# Altium project Carte_Nucleo.PrjPcb
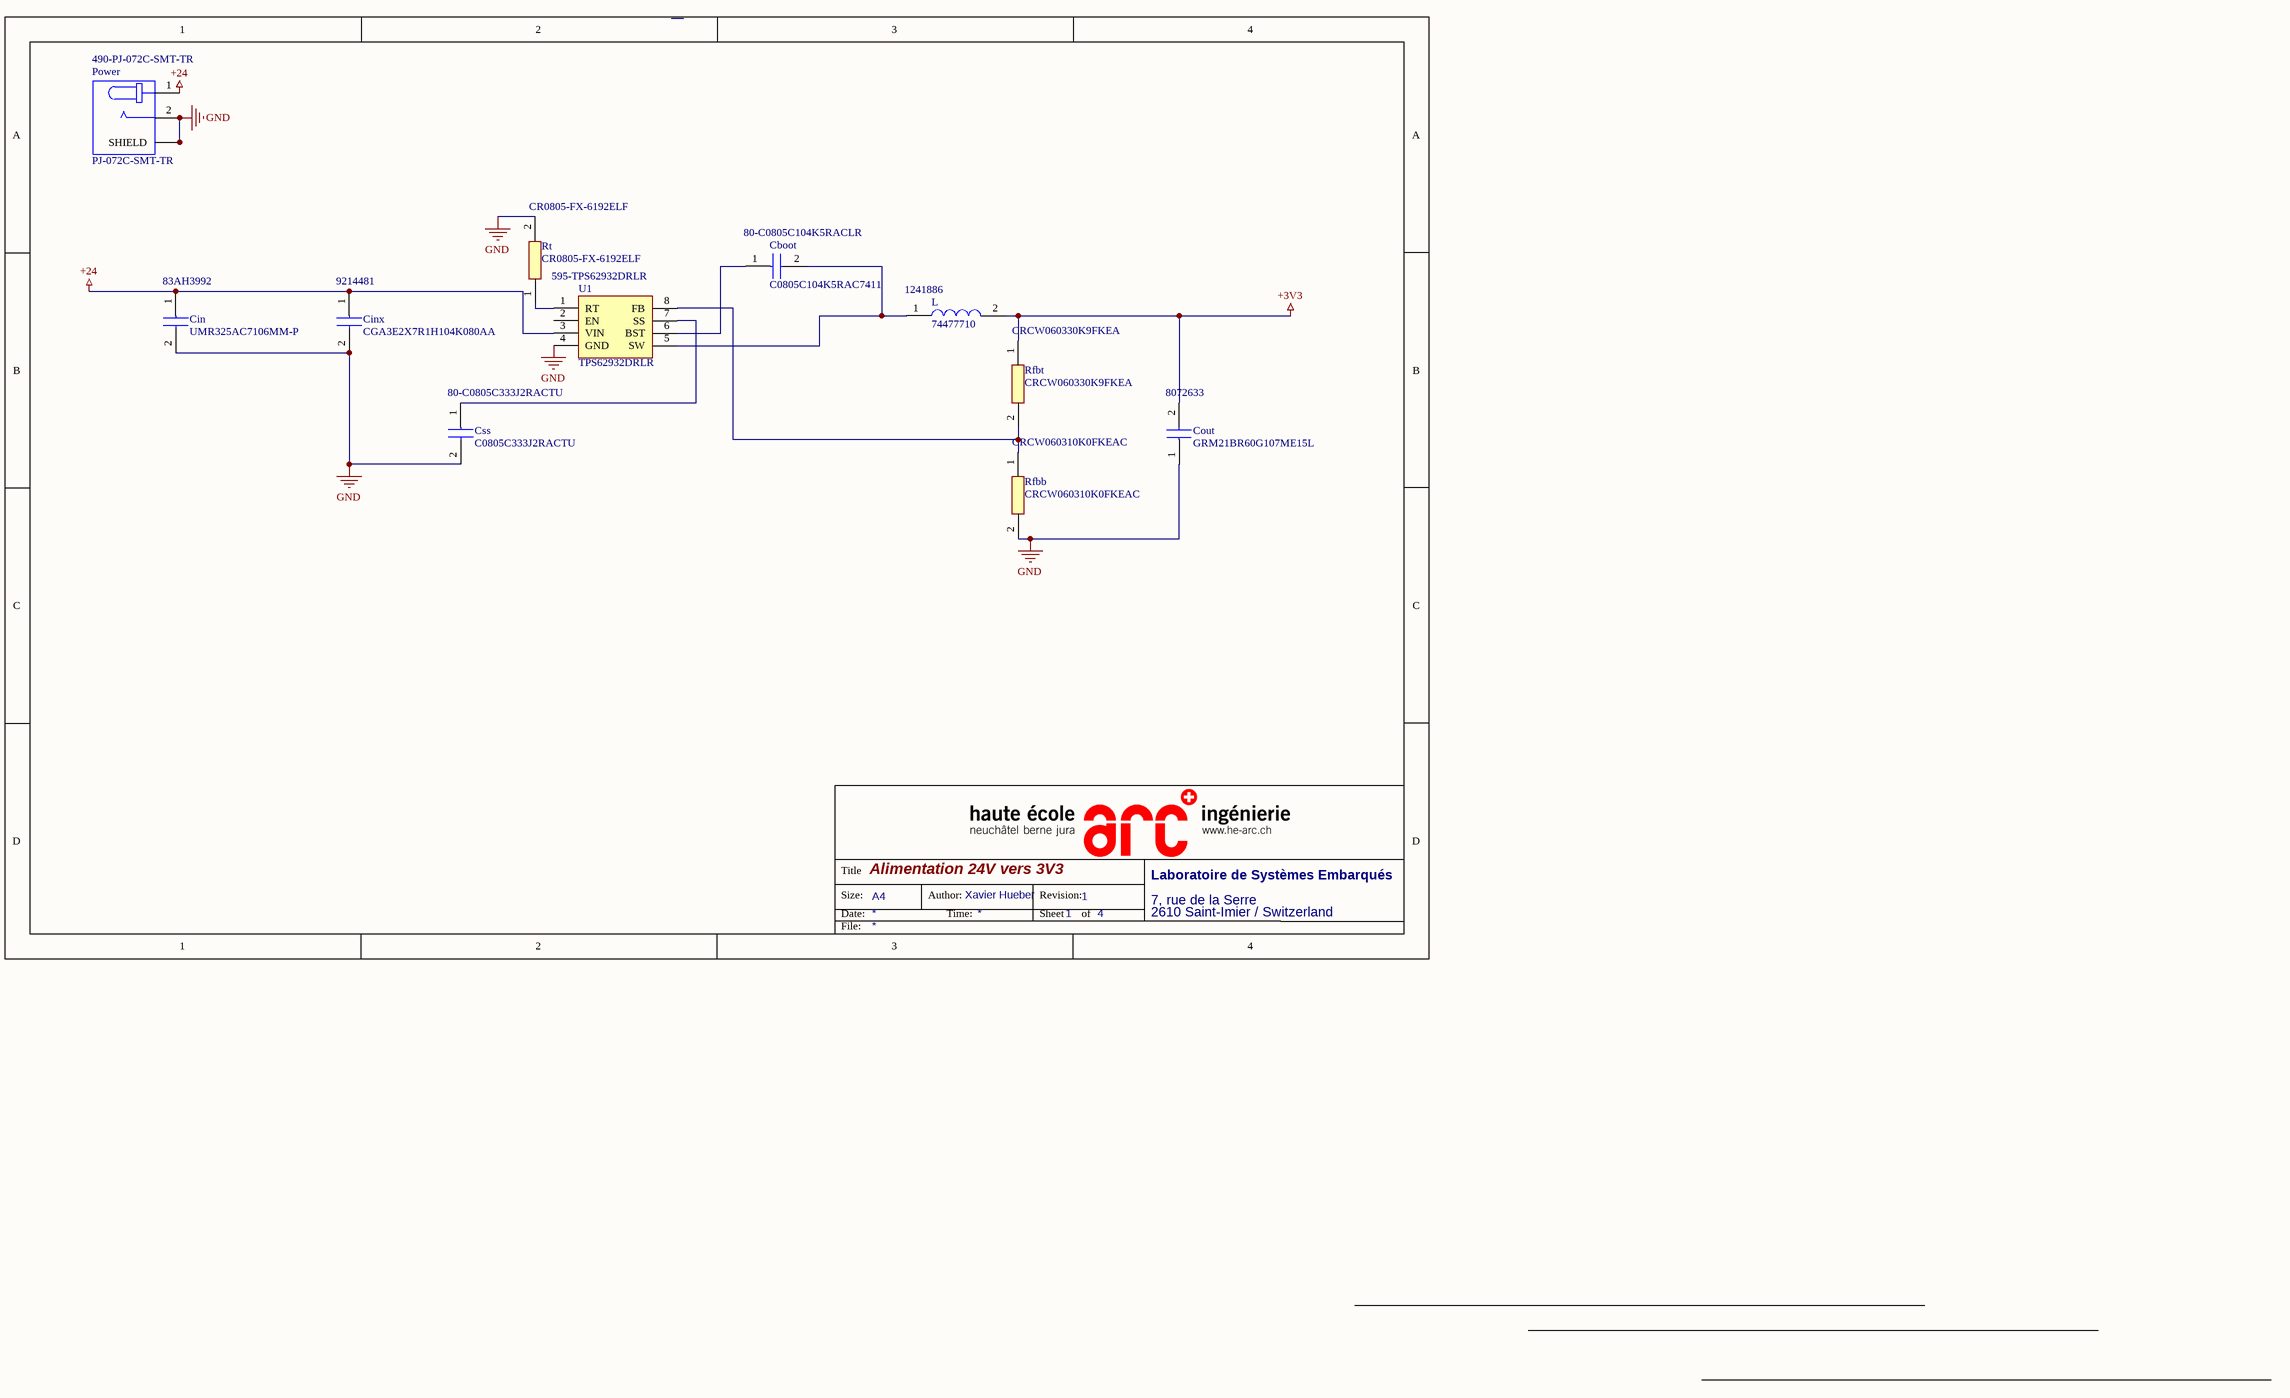
[diagram p0: Alimentation.SchDoc]
4 sheets, 66 parts. Net scope: global (net labels, ports and power ports of the same name join across sheets).
Board file: Carte_Nucleo.PcbDoc
Sheets:
  Alimentation.SchDoc
  Connecteur_Nucleo.SchDoc
  IO_Carte_Nucleo.SchDoc
  IO_Carte_Nucleo2.SchDoc

## Sheet Alimentation.SchDoc: Alimentation 24V vers 3V3
size A4; Author: Xavier Hueber; Engineer: Xavier Hueber; Organization: Altium Limited; Address1: Laboratoire de Systèmes Embarqués; Address2: 7, rue de la Serre; Address3: 2610 Saint-Imier / Switzerland; Revision: 1; SheetNumber: 1; SheetTotal: 4

### Parts
Cboot  C0805C104K5RAC7411  Supplier Part Number 1: 80-C0805C104K5RACLR  [CAPC2012X88N]
Cin  UMR325AC7106MM-P  Supplier Part Number 1: 83AH3992  [CAPC3225X280N]
Cinx  CGA3E2X7R1H104K080AA  Supplier Part Number 1: 9214481  [CAPC1608X90N]
Cout  GRM21BR60G107ME15L  Supplier Part Number 1: 8072633  [CAPC2012X145N]
Css  C0805C333J2RACTU  Supplier Part Number 1: 80-C0805C333J2RACTU  [C0805]
L  74477710  Supplier Part Number 1: 1241886  [74477710]
Power  PJ-072C-SMT-TR  Supplier Part Number 1: 490-PJ-072C-SMT-TR  [PJ-072C-SMT-TR]
Rfbb  CRCW060310K0FKEAC  [RESC1608X55N]
Rfbt  CRCW060330K9FKEA  [RESC1608X50N]
Rt  CR0805-FX-6192ELF  [RESC2012X60N]
U1  TPS62932DRLR  Supplier Part Number 1: 595-TPS62932DRLR  [TPS62932DRLR]

### Nets
+3V3: Cout.2 L.2 Rfbt.1
+24: Cin.1 Cinx.1 Power.1 U1.3(VIN)
GND: Cin.2 Cinx.2 Cout.1 Css.2 Power.2 Power.3(SHIELD) Power.4(SHIELD) Rfbb.2 Rt.2 U1.4(GND)
NetCboot_1: Cboot.1 U1.6(BST)
NetCboot_2: Cboot.2 L.1 U1.5(SW)
NetCss_1: Css.1 U1.7(SS)
NetRfbb_1: Rfbb.1 Rfbt.2 U1.8(FB)
NetRt_1: Rt.1 U1.1(RT)

Not connected (* = marked no-connect by the designer): U1 2(EN)

### Notes on the sheet
- Title
- Size:
- Date:
- A4
- Author:
- Time:
- Revision:
- Sheet
- of
- File:

### Library data of the parts
Cboot = C0805C104K5RAC7411: Multilayer Ceramic Capacitors MLCC - SMD/SMT 50V 0.1uF X7R 0805 10%; Manufacturer_Name: KEMET; Datasheet Link: https://componentsearchengine.com//C0805C104K5RAC7411.pdf; Height: 0.88mm; Mouser2 Part Number: 80-C0805C104K5RACLR; Mouser2 Price/Stock: https://www.mouser.com/Search/Refine.aspx?Keyword=80-C0805C104K5RACLR; Manufacturer_Part_Number: C0805C104K5RAC7411; Supplier 1: Mouser
Cin = UMR325AC7106MM-P: Capacitor 1210 50V 10uF +-20%; Manufacturer_Name: TAIYO YUDEN; Height: 2.8mm; Manufacturer_Part_Number: UMR325AC7106MM-P; Supplier 1: Newark
Cinx = CGA3E2X7R1H104K080AA: Capacitor 0603 100nF; Manufacturer_Name: TDK; Datasheet Link: https://componentsearchengine.com//CGA3E2X7R1H104K080AA.pdf; Height: 0.9mm; Mouser2 Part Number: 810-CGA3E2X7R1H104K; Mouser2 Price/Stock: https://www.mouser.com/Search/Refine.aspx?Keyword=810-CGA3E2X7R1H104K; Manufacturer_Part_Number: CGA3E2X7R1H104K080AA; Supplier 1: RSComponents
Cout = GRM21BR60G107ME15L: 0805 100 uF 4 V ±20% Tolerance X5R Multilayer Ceramic Chip Capacitor; Manufacturer_Name: Murata Electronics; Datasheet Link: https://datasheet.datasheetarchive.com/originals/distributors/DKDS-10/192999.pdf; Height: 1.45mm; Manufacturer_Part_Number: GRM21BR60G107ME15L; Supplier 1: Future Electronics
Css = C0805C333J2RACTU: Multilayer Ceramic Capacitors MLCC - SMD/SMT 200V 0.033uF X7R 0805 5%; Manufacturer_Name: KEMET; Datasheet Link: https://content.kemet.com/datasheets/KEM_C1002_X7R_SMD.pdf; Height: 1.1mm; Manufacturer_Part_Number: C0805C333J2RACTU; Supplier 1: Mouser
Power = PJ-072C-SMT-TR: 1.0 x 3.6 mm, 2.0 A, Horizontal, Surface Mount (SMT), Shielded, Dc Power Jack Connector; Supplier 1: Mouser
Rfbb = CRCW060310K0FKEAC: Res Thick Film 0603 10K Ohm 1% 1/10W ±100ppm/°C Molded SMD Paper T/R; Manufacturer_Name: Vishay; Datasheet Link: https://componentsearchengine.com//CRCW060310K0FKEAC.pdf; Height: 0.55mm; Mouser2 Part Number: 71-CRCW060310K0FKEAC; Mouser2 Price/Stock: https://www.mouser.com/Search/Refine.aspx?Keyword=71-CRCW060310K0FKEAC; Manufacturer_Part_Number: CRCW060310K0FKEAC; Supplier 1: Arrow Electronics; Supplier Part Number 1: CRCW060310K0FKEAC
Rfbt = CRCW060330K9FKEA: Res Thick Film 0603 30.9K Ohm 1% 1/10W ±100ppm/°C Molded SMD SMD Paper T/R; Manufacturer_Name: Vishay; Datasheet Link: http://www.vishay.com/docs/20035/dcrcwe3.pdf; Height: 0.5mm; Manufacturer_Part_Number: CRCW060330K9FKEA; Supplier 1: Arrow Electronics; Supplier Part Number 1: CRCW060330K9FKEA
Rt = CR0805-FX-6192ELF: Resistor 0805 61.9kOhm; Manufacturer_Name: Bourns; Datasheet Link: https://www.bourns.com/pdfs/chpreztr.pdf; Height: 0.6mm; Manufacturer_Part_Number: CR0805-FX-6192ELF; Supplier 1: Avnet; Supplier Part Number 1: CR0805-FX-6192ELF
U1 = TPS62932DRLR: 3.8-V to 30-V input, 2-A, 200-kHz to 2.2-MHz, low-IQ synchronous buck converter in SOT-583 package; Manufacturer_Name: Texas Instruments; Datasheet Link: https://www.ti.com/lit/gpn/tps62932; Height: 0.6mm; Manufacturer_Part_Number: TPS62932DRLR; Supplier 1: Mouser
L = 74477710: Supplier 1: RSComponents

## Sheet Connecteur_Nucleo.SchDoc: Connecteur Nucleo
size A4; Author: Xavier Hueber; Engineer: Xavier Hueber; Organization: Altium Limited; Address1: Laboratoire de Systèmes Embarqués; Address2: 7, rue de la Serre; Address3: 2610 Saint-Imier / Switzerland; DocumentNumber: 2; Revision: 1; SheetNumber: 2; SheetTotal: 4
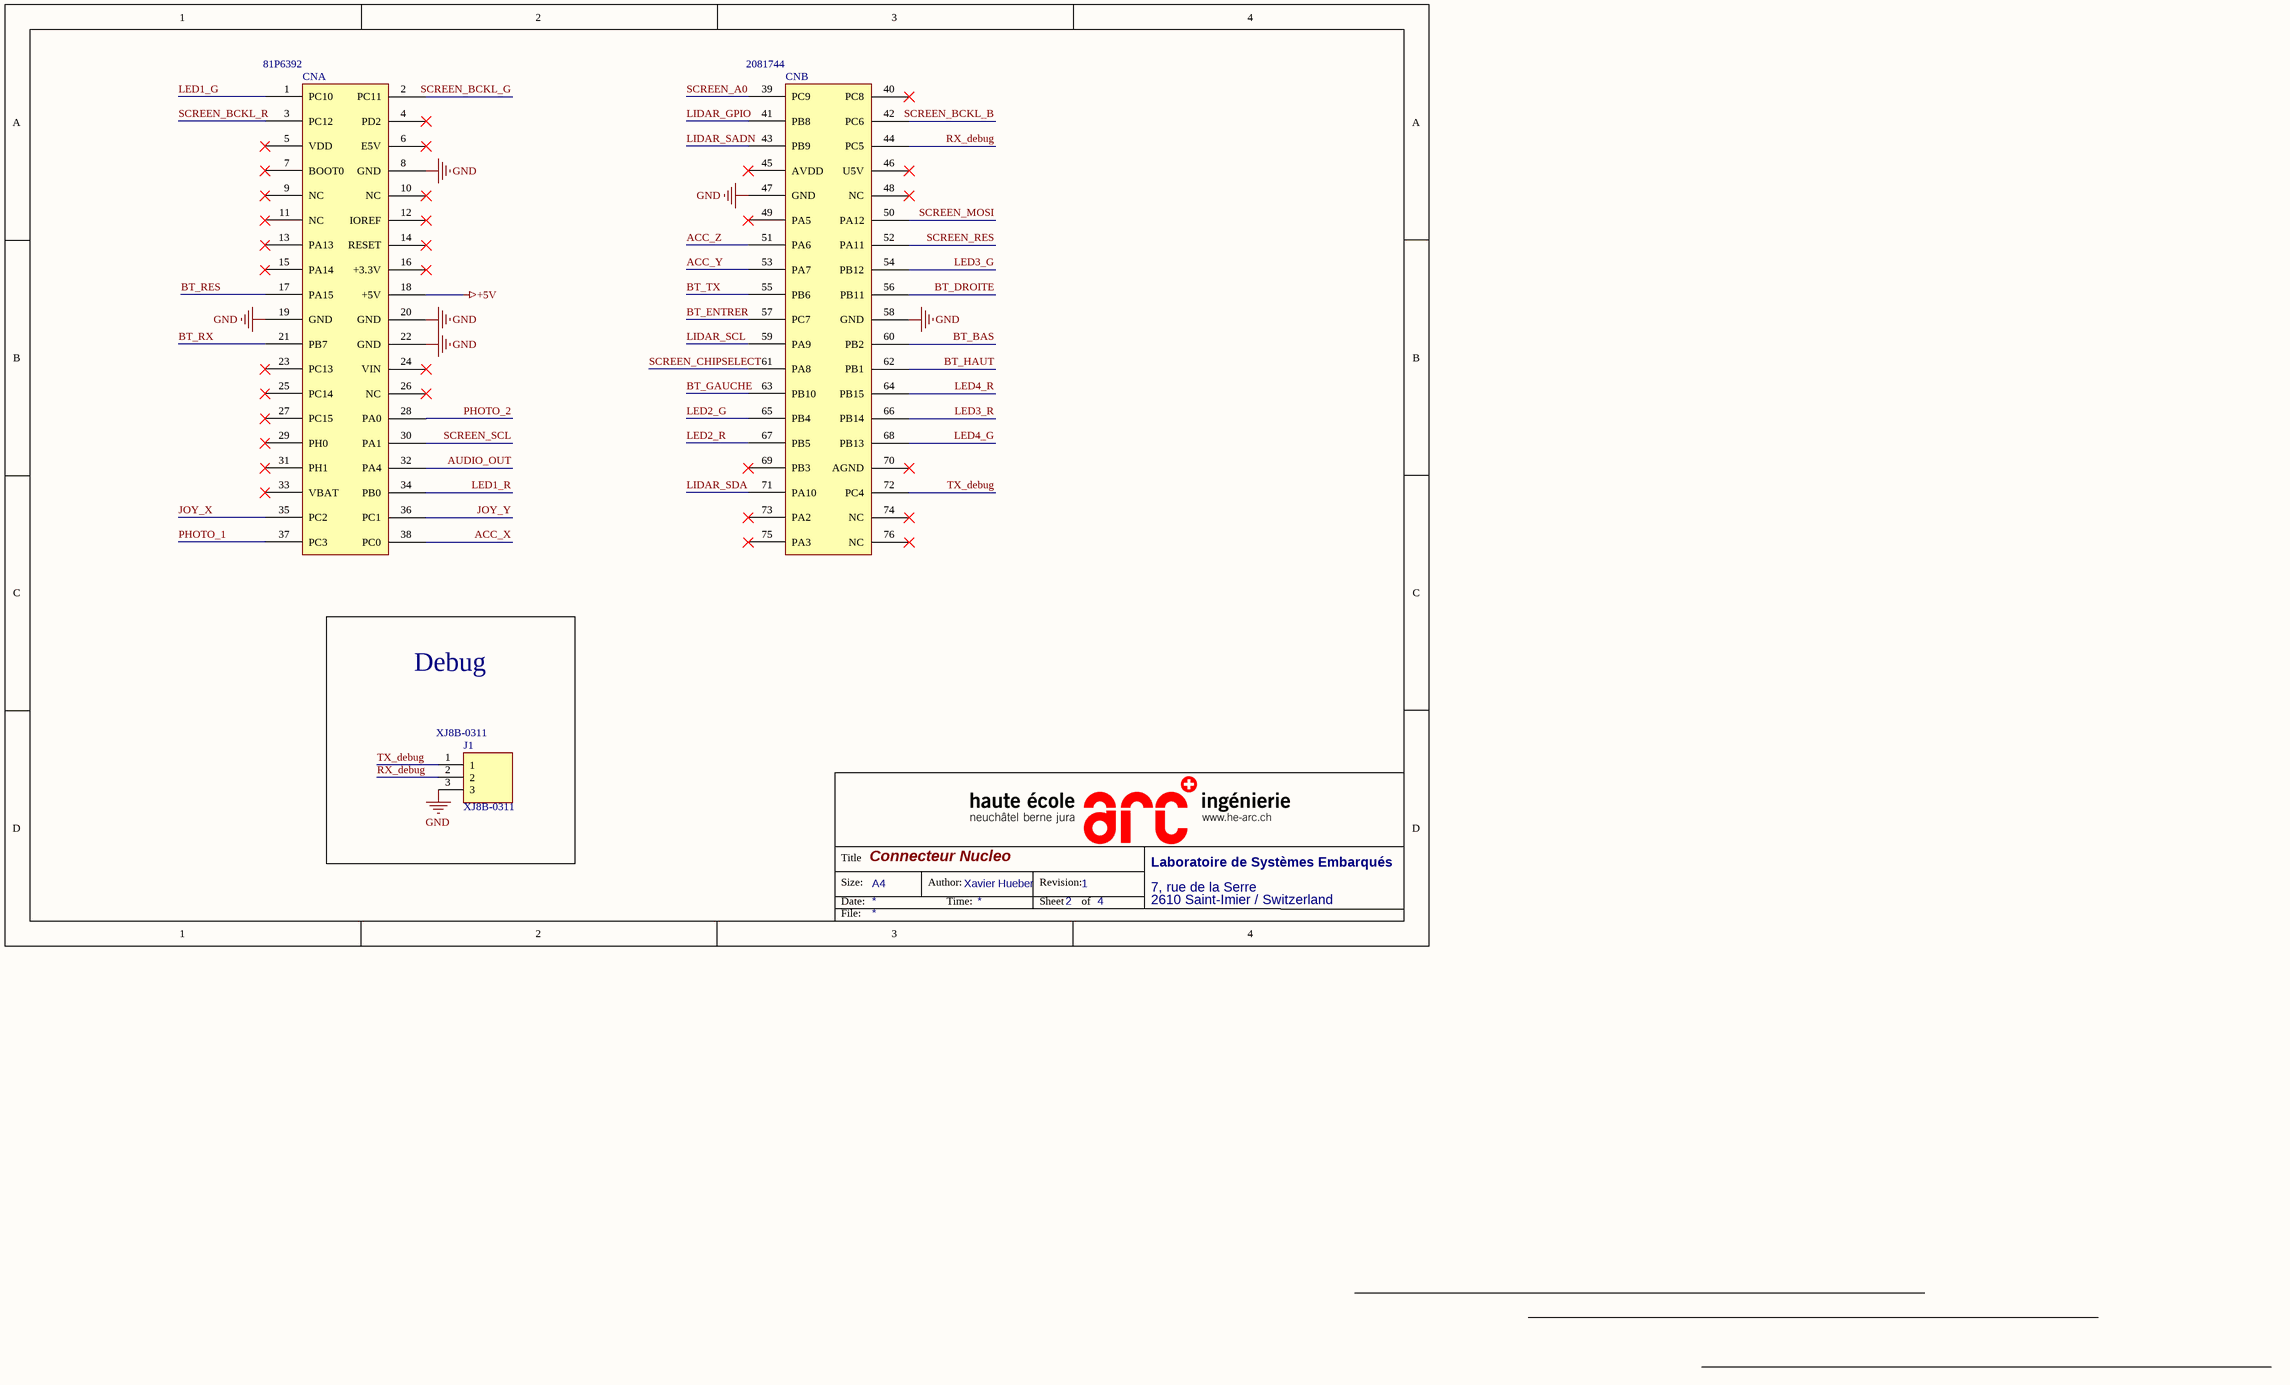
[diagram p1: Connecteur_Nucleo.SchDoc]

### Parts
CN  Supplier Part Number 1: 81P6392  [Nucleo-conn-SMD - sans 3D]  (parts A,B of 2)
J1  XJ8B-0311  [HDRV3W64P0X254_1X3_760X250X580P]

### Blocks framed on the sheet
Debug: J1

### Nets
+5V: CN.18(+5V)
GND: CN.8(GND) CN.19(GND) CN.20(GND) CN.22(GND) CN.47(GND) CN.58(GND) J1.3
ACC_X: CN.38(PC0)
ACC_Y: CN.53(PA7)
ACC_Z: CN.51(PA6)
AUDIO_OUT: CN.32(PA4)
BT_BAS: CN.60(PB2)
BT_DROITE: CN.56(PB11)
BT_ENTRER: CN.57(PC7)
BT_GAUCHE: CN.63(PB10)
BT_HAUT: CN.62(PB1)
BT_RES: CN.17(PA15)
BT_RX: CN.21(PB7)
BT_TX: CN.55(PB6)
JOY_X: CN.35(PC2)
JOY_Y: CN.36(PC1)
LED1_G: CN.1(PC10)
LED1_R: CN.34(PB0)
LED2_G: CN.65(PB4)
LED2_R: CN.67(PB5)
LED3_G: CN.54(PB12)
LED3_R: CN.66(PB14)
LED4_G: CN.68(PB13)
LED4_R: CN.64(PB15)
LIDAR_GPIO: CN.41(PB8)
LIDAR_SADN: CN.43(PB9)
LIDAR_SCL: CN.59(PA9)
LIDAR_SDA: CN.71(PA10)
PHOTO_1: CN.37(PC3)
PHOTO_2: CN.28(PA0)
RX_debug: CN.44(PC5) J1.2
SCREEN_A0: CN.39(PC9)
SCREEN_BCKL_B: CN.42(PC6)
SCREEN_BCKL_G: CN.2(PC11)
SCREEN_BCKL_R: CN.3(PC12)
SCREEN_CHIPSELECT: CN.61(PA8)
SCREEN_MOSI: CN.50(PA12)
SCREEN_RES: CN.52(PA11)
SCREEN_SCL: CN.30(PA1)
TX_debug: CN.72(PC4) J1.1

Not connected (* = marked no-connect by the designer): CN 4(PD2)* 5(VDD)* 6(E5V)* 7(BOOT0)* 9(NC)* 10(NC)* 11(NC)* 12(IOREF)* 13(PA13)* 14(RESET)* 15(PA14)* 16(+3.3V)* 23(PC13)* 24(VIN)* 25(PC14)* 26(NC)* 27(PC15)* 29(PH0)* 31(PH1)* 33(VBAT)* 40(PC8)* 45(AVDD)* 46(U5V)* 48(NC)* 49(PA5)* 69(PB3)* 70(AGND)* 73(PA2)* 74(NC)* 75(PA3)* 76(NC)*

### Notes on the sheet
- Title
- Size:
- Date:
- A4
- Author:
- Time:
- Revision:
- Sheet
- of
- File:

### Library data of the parts
CN = CN1: Headers & Wire Housings Surface Mount PCB Socket Strips, 0.100 pitch; Supplier 1: Newark
J1 = XJ8B-0311: Conn Unshrouded Header PL 3 POS 2.54mm Solder ST Top Entry Thru-Hole; Manufacturer_Name: Omron Electronics; Datasheet Link: https://www.omron.com/ecb/products/pdf/en-xj8.pdf; Height: 5.8mm; Manufacturer_Part_Number: XJ8B-0311; Supplier 1: Arrow Electronics; Supplier Part Number 1: XJ8B-0311

## Sheet IO_Carte_Nucleo.SchDoc: I/O Carte Nucleo
size A4; Author: Xavier Hueber; Engineer: Xavier Hueber; Organization: Altium Limited; Address1: Laboratoire de Systèmes Embarqués; Address2: 7, rue de la Serre; Address3: 2610 Saint-Imier / Switzerland; Revision: 1; SheetNumber: 3; SheetTotal: 4
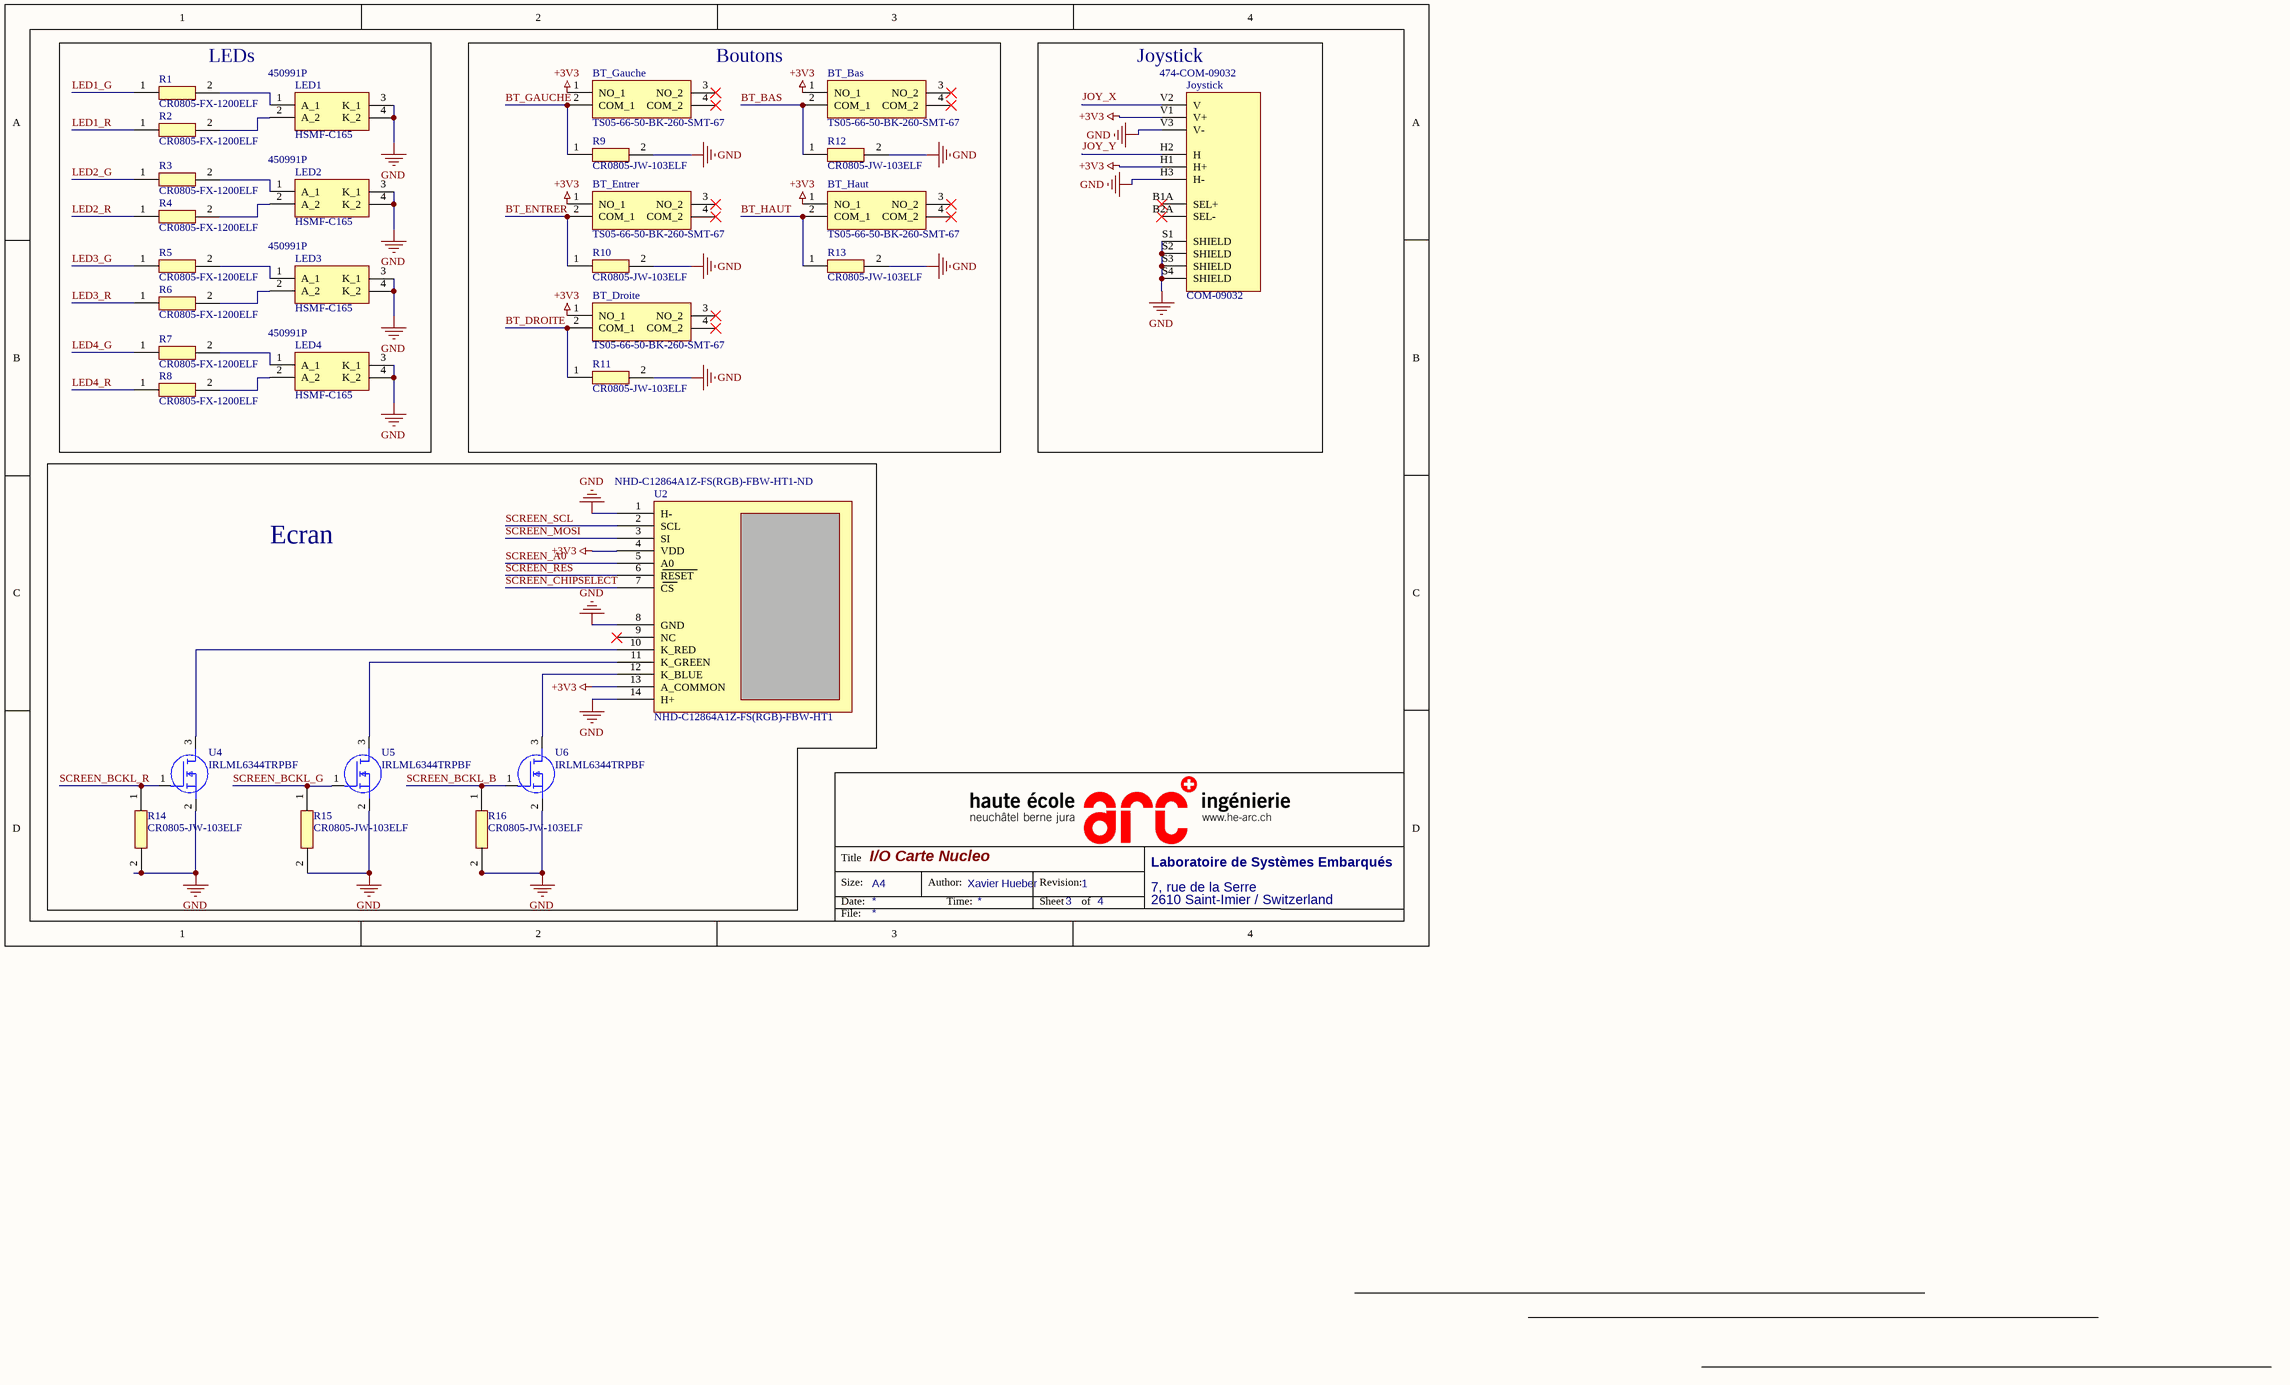
[diagram p2: IO_Carte_Nucleo.SchDoc]

### Parts
BT_Bas  TS05-66-50-BK-260-SMT-67  [TS056650BK260SMT67]
BT_Droite  TS05-66-50-BK-260-SMT-67  [TS056650BK260SMT67]
BT_Entrer  TS05-66-50-BK-260-SMT-67  [TS056650BK260SMT67]
BT_Gauche  TS05-66-50-BK-260-SMT-67  [TS056650BK260SMT67]
BT_Haut  TS05-66-50-BK-260-SMT-67  [TS056650BK260SMT67]
Joystick  COM-09032  Supplier Part Number 1: 474-COM-09032  [XDCR_COM-09032]
LED1  HSMF-C165  Supplier Part Number 1: 450991P  [HSMF-C163]
LED2  HSMF-C165  Supplier Part Number 1: 450991P  [HSMF-C163]
LED3  HSMF-C165  Supplier Part Number 1: 450991P  [HSMF-C163]
LED4  HSMF-C165  Supplier Part Number 1: 450991P  [HSMF-C163]
R1  CR0805-FX-1200ELF  [RESC2012X60N]
R2  CR0805-FX-1200ELF  [RESC2012X60N]
R3  CR0805-FX-1200ELF  [RESC2012X60N]
R4  CR0805-FX-1200ELF  [RESC2012X60N]
R5  CR0805-FX-1200ELF  [RESC2012X60N]
R6  CR0805-FX-1200ELF  [RESC2012X60N]
R7  CR0805-FX-1200ELF  [RESC2012X60N]
R8  CR0805-FX-1200ELF  [RESC2012X60N]
R9  CR0805-JW-103ELF  [RESC2012X60N]
R10  CR0805-JW-103ELF  [RESC2012X60N]
R11  CR0805-JW-103ELF  [RESC2012X60N]
R12  CR0805-JW-103ELF  [RESC2012X60N]
R13  CR0805-JW-103ELF  [RESC2012X60N]
R14  CR0805-JW-103ELF  [RESC2012X60N]
R15  CR0805-JW-103ELF  [RESC2012X60N]
R16  CR0805-JW-103ELF  [RESC2012X60N]
U2  NHD-C12864A1Z-FS(RGB)-FBW-HT1  Supplier Part Number 1: NHD-C12864A1Z-FS(RGB)-FBW-HT1-ND  [NHD-C12864A1Z-FS(RGB)-FBW-HT1]
U4  IRLML6344TRPBF  [SOT95P237X112-3N]
U5  IRLML6344TRPBF  [SOT95P237X112-3N]
U6  IRLML6344TRPBF  [SOT95P237X112-3N]

### Blocks framed on the sheet
LEDs: LED1-LED4 R1-R8
Boutons: BT_Bas BT_Droite BT_Entrer BT_Gauche BT_Haut R9-R13
Joystick: Joystick

### Nets
+3V3: BT_Bas.1(NO_1) BT_Droite.1(NO_1) BT_Entrer.1(NO_1) BT_Gauche.1(NO_1) BT_Haut.1(NO_1) Joystick.H1(H+) Joystick.V1(V+) U2.4(VDD) U2.13(A_COMMON)
GND: Joystick.H3(H-) Joystick.S1(SHIELD) Joystick.S2(SHIELD) Joystick.S3(SHIELD) Joystick.S4(SHIELD) Joystick.V3(V-) LED1.3(K_1) LED1.4(K_2) LED2.3(K_1) LED2.4(K_2) LED3.3(K_1) LED3.4(K_2) LED4.3(K_1) LED4.4(K_2) R9.2 R10.2 R11.2 R12.2 R13.2 R14.2 R15.2 R16.2 U2.1(H-) U2.8(GND) U2.14(H+) U4.2(S) U5.2(S) U6.2(S)
BT_BAS: BT_Bas.2(COM_1) R12.1
BT_DROITE: BT_Droite.2(COM_1) R11.1
BT_ENTRER: BT_Entrer.2(COM_1) R10.1
BT_GAUCHE: BT_Gauche.2(COM_1) R9.1
BT_HAUT: BT_Haut.2(COM_1) R13.1
JOY_X: Joystick.V2(V)
JOY_Y: Joystick.H2(H)
LED1_G: R1.1
LED1_R: R2.1
LED2_G: R3.1
LED2_R: R4.1
LED3_G: R5.1
LED3_R: R6.1
LED4_G: R7.1
LED4_R: R8.1
SCREEN_A0: U2.5(A0)
SCREEN_BCKL_B: R16.1 U6.1(G)
SCREEN_BCKL_G: R15.1 U5.1(G)
SCREEN_BCKL_R: R14.1 U4.1(G)
SCREEN_CHIPSELECT: U2.7(CS)
SCREEN_MOSI: U2.3(SI)
SCREEN_RES: U2.6(RESET)
SCREEN_SCL: U2.2(SCL)
NetLED1_1: LED1.1(A_1) R1.2
NetLED1_2: LED1.2(A_2) R2.2
NetLED2_1: LED2.1(A_1) R3.2
NetLED2_2: LED2.2(A_2) R4.2
NetLED3_1: LED3.1(A_1) R5.2
NetLED3_2: LED3.2(A_2) R6.2
NetLED4_1: LED4.1(A_1) R7.2
NetLED4_2: LED4.2(A_2) R8.2
NetU2_10: U2.10(K_RED) U4.3(D)
NetU2_11: U2.11(K_GREEN) U5.3(D)
NetU2_12: U2.12(K_BLUE) U6.3(D)

Not connected (* = marked no-connect by the designer): BT_Bas 3(NO_2)* 4(COM_2)*; BT_Droite 3(NO_2)* 4(COM_2)*; BT_Entrer 3(NO_2)* 4(COM_2)*; BT_Gauche 3(NO_2)* 4(COM_2)*; BT_Haut 3(NO_2)* 4(COM_2)*; Joystick B1A(SEL+)* B2A(SEL-)*; U2 9(NC)*

### Notes on the sheet
- Ecran
- Title
- Size:
- Date:
- A4
- Author:
- Time:
- Revision:
- Sheet
- of
- File:

### Library data of the parts
BT_Bas BT_Droite BT_Entrer BT_Gauche BT_Haut = TS05-66-50-BK-260-SMT-67: 6 x 6 mm, 4.3 ~ 8 mm Actuator Height, 100 ~ 260 gf, Surface Mount, IP67, SPST, Tactile Switch; Datasheet Link: https://www.cuidevices.com/product/resource/ts05.pdf; Height: 5.2mm; Supplier 1: Mouser; Supplier Part Number 1: 179-TS056650260SMT67
Joystick = COM-09032: Thumb Joystick; Price: None; Package: None; Availability: Unavailable; MP: COM-09032; Value: *; Supplier 1: Mouser
LED1-LED4 = HSMF-C165: Standard LEDs - SMD Grn/Red Bi-Color; Manufacturer_Name: Avago Technologies; Datasheet Link: https://componentsearchengine.com//HSMF-C165.pdf; Mouser2 Part Number: 630-HSMF-C165; Mouser2 Price/Stock: https://www.mouser.com/Search/Refine.aspx?Keyword=630-HSMF-C165; Manufacturer_Part_Number: HSMF-C165; Supplier 1: RSComponents
R1-R8 = CR0805-FX-1200ELF: Res Thick Film 0805 120 Ohm 1% 1/8W ±100ppm/°C Molded SMD SMD Paper Tape on Plastic Reel; Datasheet Link: https://www.bourns.com/pdfs/chpreztr.pdf; Height: 0.6mm; Supplier 1: Arrow Electronics; Supplier Part Number 1: CR0805-FX-1200ELF
R9-R16 = CR0805-JW-103ELF: BOURNS         CR0805-JW-103ELF            Surface Mount Chip Resistor, Thick Film, CR Series, 10 kohm, 125 mW,  5%, 150 V; Datasheet Link: https://componentsearchengine.com//CR0805-JW-103ELF.pdf; Height: 0.6mm; Supplier 1: Arrow Electronics; Supplier Part Number 1: CR0805-JW-103ELF
U2 = NHD-C12864A1Z-FS(RGB)-FBW-HT1: LCD COG GRAPH 128X64 RGB BKLT; Supplier 1: Digi-Key
U4-U6 = IRLML6344TRPBF: MOSFET (N-Channel); Manufacturer_Name: Infineon; Datasheet Link: https://componentsearchengine.com//IRLML6344TRPBF.pdf; Height: 1.12mm; Mouser2 Part Number: 942-IRLML6344TRPBF; Mouser2 Price/Stock: https://www.mouser.com/Search/Refine.aspx?Keyword=942-IRLML6344TRPBF; Manufacturer_Part_Number: IRLML6344TRPBF

## Sheet IO_Carte_Nucleo2.SchDoc: I/O Carte Nucleo
size A4; Author: Xavier Hueber; Engineer: Xavier Hueber; Organization: Altium Limited; Address1: Laboratoire de Systèmes Embarqués; Address2: 7, rue de la Serre; Address3: 2610 Saint-Imier / Switzerland; Revision: 1; SheetNumber: 4; SheetTotal: 4
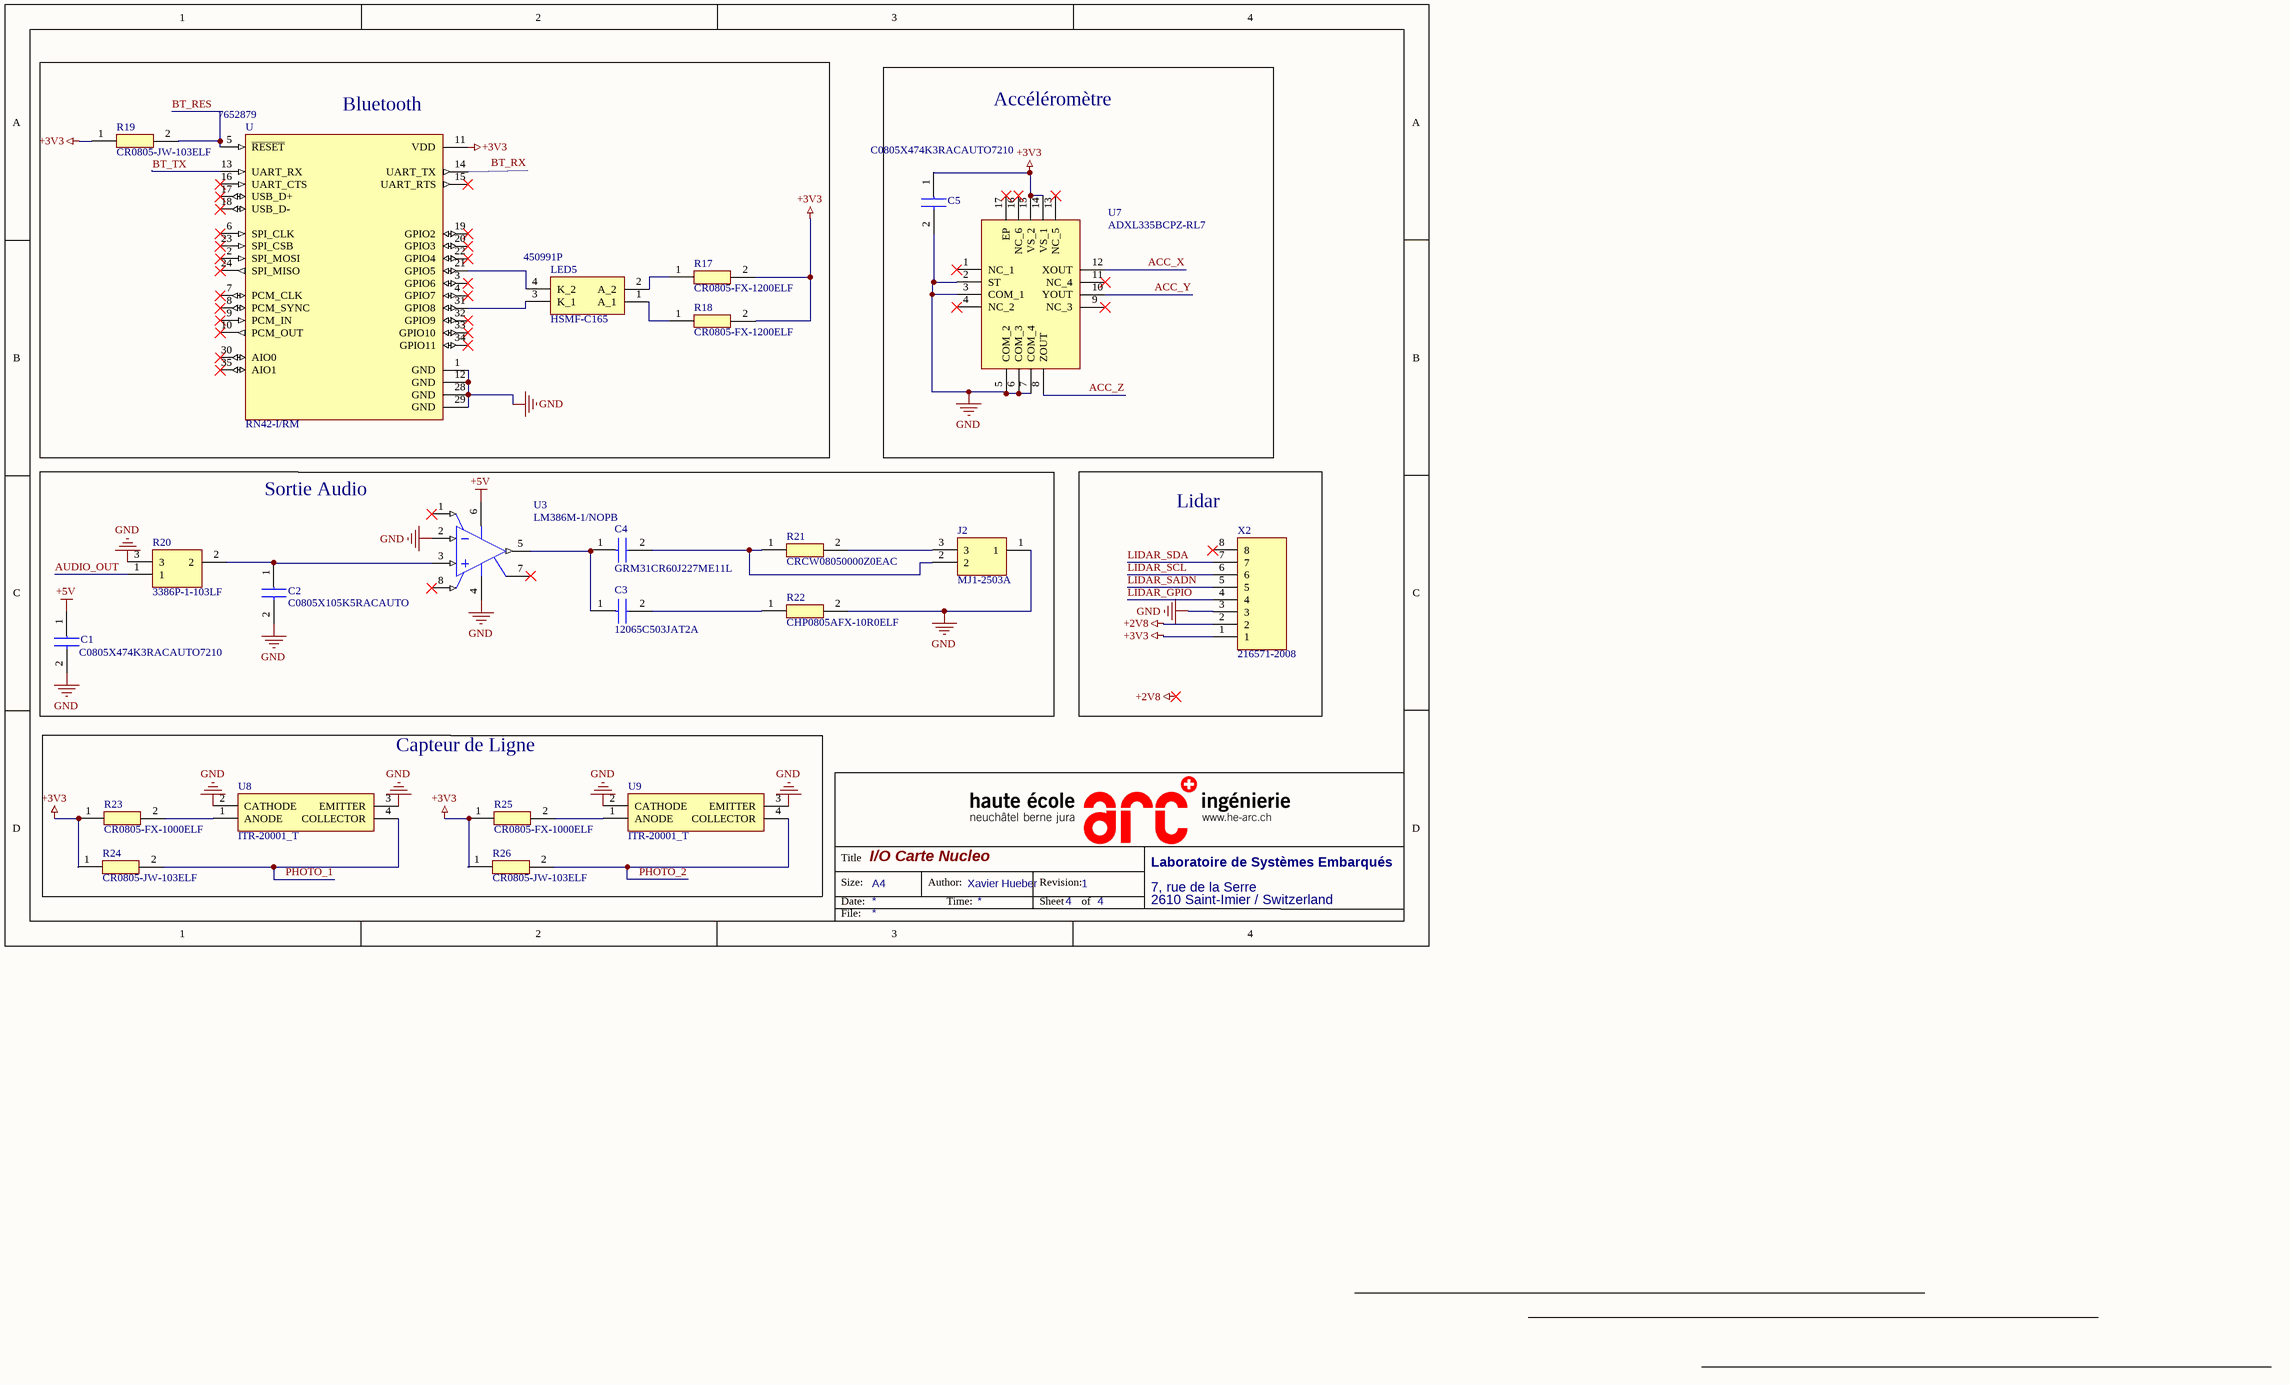
[diagram p3: IO_Carte_Nucleo2.SchDoc]

### Parts
C1  C0805X474K3RACAUTO7210  [C0805]
C2  C0805X105K5RACAUTO  [CAPC2012X145N]
C3  12065C503JAT2A  [CAPC3216X94N]
C4  GRM31CR60J227ME11L  [CAPC3216X190N]
C5  C0805X474K3RACAUTO7210  [C0805]
J2  MJ1-2503A  [MJ12503A]
LED5  HSMF-C165  Supplier Part Number 1: 450991P  [HSMF-C163]
R17  CR0805-FX-1200ELF  [RESC2012X60N]
R18  CR0805-FX-1200ELF  [RESC2012X60N]
R19  CR0805-JW-103ELF  [RESC2012X60N]
R20  3386P-1-103LF  [3386P_1]
R21  CRCW08050000Z0EAC  [RESC2012X60N]
R22  CHP0805AFX-10R0ELF  [RESC2012X60N]
R23  CR0805-FX-1000ELF  [RESC2012X60N]
R24  CR0805-JW-103ELF  [RESC2012X60N]
R25  CR0805-FX-1000ELF  [RESC2012X60N]
R26  CR0805-JW-103ELF  [RESC2012X60N]
U  RN42-I/RM  Supplier Part Number 1: 7652879  [XCVR_RN42-I/RM]
U3  LM386M-1/NOPB  [TI-D8_M]
U7  ADXL335BCPZ-RL7  [QFN65P400X400X150-17N-D]
U8  ITR-20001_T  [ITR20001T]
U9  ITR-20001_T  [ITR20001T]
X2  216571-2008  [216571-YY08]

### Blocks framed on the sheet
Bluetooth: LED5 R17-R19 U
Accéléromètre: C5 U7
Sortie Audio: C1-C4 J2 R20-R22 U3
Lidar: X2
Capteur de Ligne: R23-R26 U8 U9

### Nets
+2V8: X2.2
+3V3: C5.1 R17.2 R18.2 R19.1 R23.1 R24.1 R25.1 R26.1 U.11(VDD) U7.14(VS_1) U7.15(VS_2) X2.1
+5V: C1.1 U3.6(VS)
GND: C1.2 C2.2 C5.2 J2.1 R20.3 R22.2 U.1(GND) U.12(GND) U.28(GND) U.29(GND) U3.2(IN-) U3.4(GND) U7.2(ST) U7.3(COM_1) U7.5(COM_2) U7.6(COM_3) U7.7(COM_4) U8.2(CATHODE) U8.3(EMITTER) U9.2(CATHODE) U9.3(EMITTER) X2.3
ACC_X: U7.12(XOUT)
ACC_Y: U7.10(YOUT)
ACC_Z: U7.8(ZOUT)
AUDIO_OUT: R20.1
BT_RES: R19.2 U.5(~{RESET})
BT_RX: U.14(UART_TX)
BT_TX: U.13(UART_RX)
LIDAR_GPIO: X2.4
LIDAR_SADN: X2.5
LIDAR_SCL: X2.6
LIDAR_SDA: X2.7
PHOTO_1: R24.2 U8.4(COLLECTOR)
PHOTO_2: R26.2 U9.4(COLLECTOR)
NetC2_1: C2.1 R20.2 U3.3(IN+)
NetC3_1: C3.1(C1) C4.1 U3.5(VOUT)
NetC3_2: C3.2(C2) R22.1
NetC4_2: C4.2 J2.2 R21.1
NetJ2_3: J2.3 R21.2
NetLED5_1: LED5.1(A_1) R18.1
NetLED5_2: LED5.2(A_2) R17.1
NetLED5_3: LED5.3(K_1) U.31(GPIO8)
NetLED5_4: LED5.4(K_2) U.21(GPIO5)
NetR23_2: R23.2 U8.1(ANODE)
NetR25_2: R25.2 U9.1(ANODE)

Not connected (* = marked no-connect by the designer): U 2(SPI_MOSI)* 3(GPIO6)* 4(GPIO7)* 6(SPI_CLK)* 7(PCM_CLK)* 8(PCM_SYNC)* 9(PCM_IN)* 10(PCM_OUT)* 15(UART_RTS)* 16(UART_CTS)* 17(USB_D+)* 18(USB_D-)* 19(GPIO2)* 20(GPIO3)* 22(GPIO4)* 23(SPI_CSB)* 24(SPI_MISO)* 30(AIO0)* 32(GPIO9)* 33(GPIO10)* 34(GPIO11)* 35(AIO1)*; U3 1(GAIN)* 7(BYPASS)* 8(GAIN)*; U7 1(NC_1)* 4(NC_2)* 9(NC_3)* 11(NC_4)* 13(NC_5)* 16(NC_6)* 17(EP)*; X2 8*

### Notes on the sheet
- Title
- Size:
- Date:
- A4
- Author:
- Time:
- Revision:
- Sheet
- of
- File:
- Labels drawn without touching a wire or pin: +2V8

### Library data of the parts
C1 C5 = C0805X474K3RACAUTO7210: Capacitor; Manufacturer_Name: KEMET; Datasheet Link: https://content.kemet.com/datasheets/KEM_C1078_X7R_FT-CAP_AUTO_SMD.pdf; Height: 1.1mm; Manufacturer_Part_Number: C0805X474K3RACAUTO7210
C2 = C0805X105K5RACAUTO: Capacitor; Manufacturer_Name: KEMET; Datasheet Link: https://connect.kemet.com:7667/gateway/IntelliData-ComponentDocumentation/1.0/download/specsheet/C0805X105K5RACAUTO; Height: 1.45mm; Manufacturer_Part_Number: C0805X105K5RACAUTO
C3 = 12065C503JAT2A: Capacitor; Manufacturer_Name: AVX; Manufacturer_Part_Number: 12065C503JAT2A
C4 = GRM31CR60J227ME11L: Capacitor; Manufacturer_Name: Murata Electronics; Datasheet Link: https://www.murata.com/products/productdetail?partno=GRM31CR60J227ME11%23; Height: 1.9mm; Manufacturer_Part_Number: GRM31CR60J227ME11L
J2 = MJ1-2503A: Connector; Manufacturer_Name: CUI Inc.; Datasheet Link: https://componentsearchengine.com//MJ1-2503A.pdf; Height: 5mm; Mouser2 Part Number: 490-MJ1-2503A; Mouser2 Price/Stock: https://www.mouser.com/Search/Refine.aspx?Keyword=490-MJ1-2503A; Manufacturer_Part_Number: MJ1-2503A
LED5 = HSMF-C165: LED Bi-Color Green/Red 570nm/636nm 4-Pin Chip 0603 T/R; Manufacturer_Name: Avago Technologies; Datasheet Link: https://componentsearchengine.com//HSMF-C165.pdf; Mouser2 Part Number: 630-HSMF-C165; Mouser2 Price/Stock: https://www.mouser.com/Search/Refine.aspx?Keyword=630-HSMF-C165; Manufacturer_Part_Number: HSMF-C165; Supplier 1: RSComponents
R17 R18 = CR0805-FX-1200ELF: Resistor; Manufacturer_Name: Bourns; Datasheet Link: https://www.bourns.com/pdfs/chpreztr.pdf; Height: 0.6mm; Manufacturer_Part_Number: CR0805-FX-1200ELF
R19 = CR0805-JW-103ELF: as R9 on sheet IO_Carte_Nucleo; Datasheet Link: https://componentsearchengine.com//CR0805-JW-103ELF.pdf; Height: 0.6mm; Supplier 1: Arrow Electronics; Supplier Part Number 1: CR0805-JW-103ELF
R20 = 3386P-1-103LF: Resistor; Manufacturer_Name: Bourns; Datasheet Link: https://componentsearchengine.com//3386P-1-103LF.pdf; Mouser2 Part Number: 652-3386P-1-103LF; Mouser2 Price/Stock: https://www.mouser.com/Search/Refine.aspx?Keyword=652-3386P-1-103LF; Manufacturer_Part_Number: 3386P-1-103LF
R21 = CRCW08050000Z0EAC: Resistor; Manufacturer_Name: Vishay; Datasheet Link: https://componentsearchengine.com//CRCW08050000Z0EAC.pdf; Height: 0.6mm; Mouser2 Part Number: 71-CRCW08050000Z0EAC; Mouser2 Price/Stock: https://www.mouser.com/Search/Refine.aspx?Keyword=71-CRCW08050000Z0EAC; Manufacturer_Part_Number: CRCW08050000Z0EAC
R22 = CHP0805AFX-10R0ELF: Resistor; Manufacturer_Name: Bourns; Datasheet Link: https://www.mouser.co.uk/datasheet/2/54/chp-a-1858677.pdf; Height: 0.6mm; Manufacturer_Part_Number: CHP0805AFX-10R0ELF
R23 R25 = CR0805-FX-1000ELF: Resistor; Manufacturer_Name: Bourns; Datasheet Link: https://www.bourns.com/pdfs/chpreztr.pdf; Height: 0.6mm; Manufacturer_Part_Number: CR0805-FX-1000ELF
R24 R26 = CR0805-JW-103ELF: Resistor; Manufacturer_Name: Bourns; Datasheet Link: https://componentsearchengine.com//CR0805-JW-103ELF.pdf; Height: 0.6mm; Mouser2 Part Number: 652-CR0805-JW-103ELF; Mouser2 Price/Stock: https://www.mouser.com/Search/Refine.aspx?Keyword=652-CR0805-JW-103ELF; Manufacturer_Part_Number: CR0805-JW-103ELF
U = RN42-I/RM: Bluetooth Bluetooth v2.1 +EDR, Class 2 Transceiver Module 2.4GHz Integrated, Trace Surface Mount; MF: Microchip; Value: *; Price: None; MP: RN42-I/RM; Availability: Unavailable; SnapEDA_Link: https://www.snapeda.com/parts/RN42-I/RM/Microchip/view-part/625546/?ref=snap; Package: SMD-35 Roving Networks; Supplier 1: RSComponents
U3 = CMP-0994-00001-1: Low Voltage Audio Power Amplifier, 0 to 70 degC, 8-pin SOIC (D8), Green (RoHS & no Sb/Br); Manufacturer: Texas Instruments; Input Type: Analog; SubFamily: Mid/High-Power Amplifier; Max. Number of Speaker Outputs: 1; PackageVersion: 4040047-3/M, 06/2011; ComponentLink2Description: Datasheet; DatasheetVersion: SNAS545A; ComponentLink3URL: http://www.ti.com/litv/pdf/msoi002j; ComponentLink1URL: http://www.ti.com/; Mounting Technology: Surface Mount; Eco-Plan: Green (RoHS & no Sb/Br); ComponentLink3Description: Package Specification; ComponentLink2URL: http://www.ti.com/general/docs/lit/getliterature.tsp?genericPartNumber=LM386&fileType=pdf; PartNumber: LM386M-1/NOPB; PackageDescription: 8-Pin Plastic Small Outline, Body 4.9 x 3.9 mm, Pitch 1.27 mm; ComponentLink1Description: Manufacturer URL; Code_JEDEC: MS-012; PackageReference: D8
U7 = ADXL335BCPZ-RL7: Integrated Circuit; Manufacturer_Name: Analog Devices; Datasheet Link: https://componentsearchengine.com//ADXL335BCPZ-RL7.pdf; Height: 1.5mm; Mouser2 Part Number: 584-ADXL335BCPZ-R7; Mouser2 Price/Stock: https://www.mouser.com/Search/Refine.aspx?Keyword=584-ADXL335BCPZ-R7; Manufacturer_Part_Number: ADXL335BCPZ-RL7
U8 U9 = ITR-20001_T: Undefined or Miscellaneous; Manufacturer_Name: Everlight; Manufacturer_Part_Number: ITR-20001/T; Height: 6.8mm
X2 = 216571-2008: Connector; Manufacturer_Name: Molex; Datasheet Link: https://www.molex.com/pdm_docs/sd/2165711002_sd.pdf; Height: 9.91mm; Manufacturer_Part_Number: 216571-2008

## Nets that join several sheets
+3V3: Alimentation (Cout.2 L.2 Rfbt.1), IO_Carte_Nucleo (9 pins), IO_Carte_Nucleo2 (12 pins)
+5V: Connecteur_Nucleo (CN.18), IO_Carte_Nucleo2 (C1.1 U3.6)
GND: Alimentation (10 pins), Connecteur_Nucleo (7 pins), IO_Carte_Nucleo (28 pins), IO_Carte_Nucleo2 (22 pins)
ACC_X: Connecteur_Nucleo (CN.38), IO_Carte_Nucleo2 (U7.12)
ACC_Y: Connecteur_Nucleo (CN.53), IO_Carte_Nucleo2 (U7.10)
ACC_Z: Connecteur_Nucleo (CN.51), IO_Carte_Nucleo2 (U7.8)
AUDIO_OUT: Connecteur_Nucleo (CN.32), IO_Carte_Nucleo2 (R20.1)
BT_BAS: Connecteur_Nucleo (CN.60), IO_Carte_Nucleo (BT_Bas.2 R12.1)
BT_DROITE: Connecteur_Nucleo (CN.56), IO_Carte_Nucleo (BT_Droite.2 R11.1)
BT_ENTRER: Connecteur_Nucleo (CN.57), IO_Carte_Nucleo (BT_Entrer.2 R10.1)
BT_GAUCHE: Connecteur_Nucleo (CN.63), IO_Carte_Nucleo (BT_Gauche.2 R9.1)
BT_HAUT: Connecteur_Nucleo (CN.62), IO_Carte_Nucleo (BT_Haut.2 R13.1)
BT_RES: Connecteur_Nucleo (CN.17), IO_Carte_Nucleo2 (R19.2 U.5)
BT_RX: Connecteur_Nucleo (CN.21), IO_Carte_Nucleo2 (U.14)
BT_TX: Connecteur_Nucleo (CN.55), IO_Carte_Nucleo2 (U.13)
JOY_X: Connecteur_Nucleo (CN.35), IO_Carte_Nucleo (Joystick.V2)
JOY_Y: Connecteur_Nucleo (CN.36), IO_Carte_Nucleo (Joystick.H2)
LED1_G: Connecteur_Nucleo (CN.1), IO_Carte_Nucleo (R1.1)
LED1_R: Connecteur_Nucleo (CN.34), IO_Carte_Nucleo (R2.1)
LED2_G: Connecteur_Nucleo (CN.65), IO_Carte_Nucleo (R3.1)
LED2_R: Connecteur_Nucleo (CN.67), IO_Carte_Nucleo (R4.1)
LED3_G: Connecteur_Nucleo (CN.54), IO_Carte_Nucleo (R5.1)
LED3_R: Connecteur_Nucleo (CN.66), IO_Carte_Nucleo (R6.1)
LED4_G: Connecteur_Nucleo (CN.68), IO_Carte_Nucleo (R7.1)
LED4_R: Connecteur_Nucleo (CN.64), IO_Carte_Nucleo (R8.1)
LIDAR_GPIO: Connecteur_Nucleo (CN.41), IO_Carte_Nucleo2 (X2.4)
LIDAR_SADN: Connecteur_Nucleo (CN.43), IO_Carte_Nucleo2 (X2.5)
LIDAR_SCL: Connecteur_Nucleo (CN.59), IO_Carte_Nucleo2 (X2.6)
LIDAR_SDA: Connecteur_Nucleo (CN.71), IO_Carte_Nucleo2 (X2.7)
PHOTO_1: Connecteur_Nucleo (CN.37), IO_Carte_Nucleo2 (R24.2 U8.4)
PHOTO_2: Connecteur_Nucleo (CN.28), IO_Carte_Nucleo2 (R26.2 U9.4)
SCREEN_A0: Connecteur_Nucleo (CN.39), IO_Carte_Nucleo (U2.5)
SCREEN_BCKL_B: Connecteur_Nucleo (CN.42), IO_Carte_Nucleo (R16.1 U6.1)
SCREEN_BCKL_G: Connecteur_Nucleo (CN.2), IO_Carte_Nucleo (R15.1 U5.1)
SCREEN_BCKL_R: Connecteur_Nucleo (CN.3), IO_Carte_Nucleo (R14.1 U4.1)
SCREEN_CHIPSELECT: Connecteur_Nucleo (CN.61), IO_Carte_Nucleo (U2.7)
SCREEN_MOSI: Connecteur_Nucleo (CN.50), IO_Carte_Nucleo (U2.3)
SCREEN_RES: Connecteur_Nucleo (CN.52), IO_Carte_Nucleo (U2.6)
SCREEN_SCL: Connecteur_Nucleo (CN.30), IO_Carte_Nucleo (U2.2)